# Altium schematic sheet Plugs.SchDoc
size A4
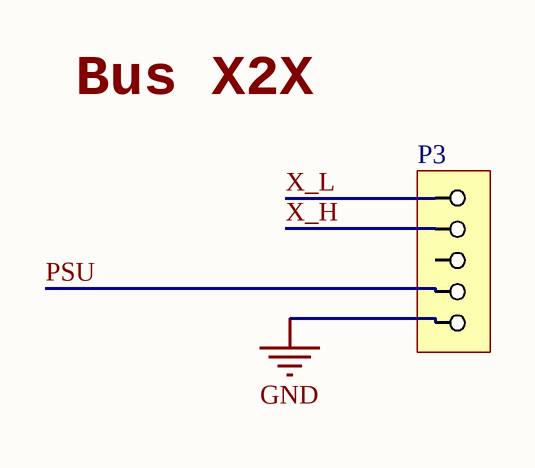
[diagram p0: Plugs.SchDoc]

## Parts
P3  (no value)  [MSTBA 1757271]

## Nets
GND: P3.5
PSU: P3.4
X_H: P3.2
X_L: P3.1

Not connected (* = marked no-connect by the designer): P3 3

## Notes on the sheet
- Bus X2X

## Library data of the parts
P3 = MSTBA 2,5/ 5-G-5,08 - 1757271: Part Description: Pluggable Terminal Blocks 5 Pos; Part Number: MSTBA 2,5/ 5-G-5,08 - 1757271